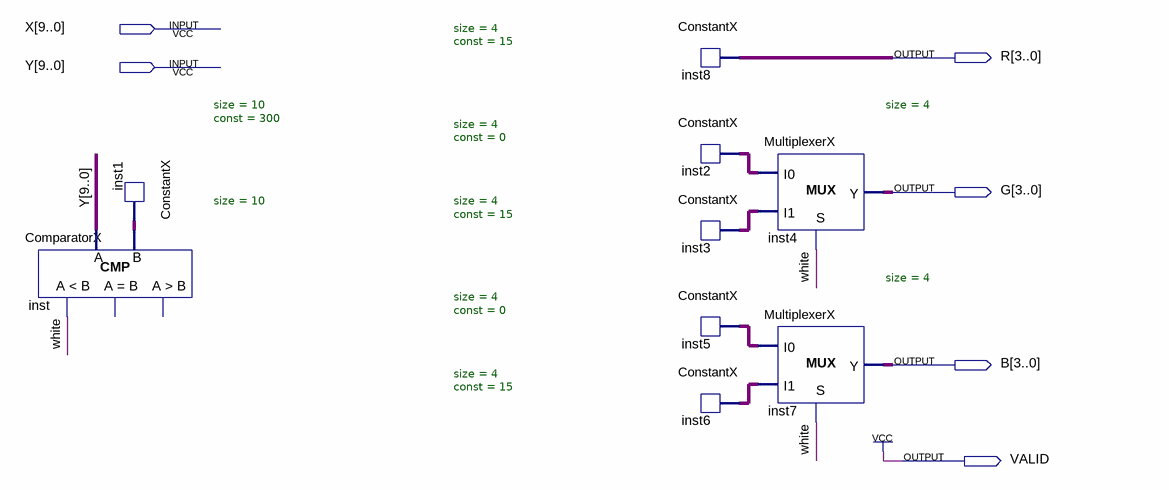
[diagram p0: schematic sheet]
// Quartus schematic Layer0.bdf as structural Verilog: 9 symbols, 6 pins
module Layer0 (
  input  [9:0] X,
  input  [9:0] Y,
  output [3:0] R,
  output [3:0] G,
  output [3:0] B,
  output VALID
);

  wire white;
  wire [3:0] inst2_data_out, inst3_data_out, inst5_data_out, inst6_data_out;
  wire [9:0] inst1_data_out;

  ComparatorX #(.size(10)) inst (.A(Y), .B(inst1_data_out), .LS(white));  // open: EQ, GR
  ConstantX #(.size(10), .\const (300)) inst1 (.DATA_OUT(inst1_data_out));
  ConstantX #(.size(4), .\const (15)) inst8 (.DATA_OUT(R));
  ConstantX #(.size(4), .\const (0)) inst2 (.DATA_OUT(inst2_data_out));
  ConstantX #(.size(4), .\const (15)) inst3 (.DATA_OUT(inst3_data_out));
  ConstantX #(.size(4), .\const (0)) inst5 (.DATA_OUT(inst5_data_out));
  ConstantX #(.size(4), .\const (15)) inst6 (.DATA_OUT(inst6_data_out));
  MultiplexerX #(.size(4)) inst4 (.S(white), .I0(inst2_data_out), .I1(inst3_data_out), .Y(G));
  MultiplexerX #(.size(4)) inst7 (.S(white), .I0(inst5_data_out), .I1(inst6_data_out), .Y(B));

  assign VALID = 1'b1;
endmodule
